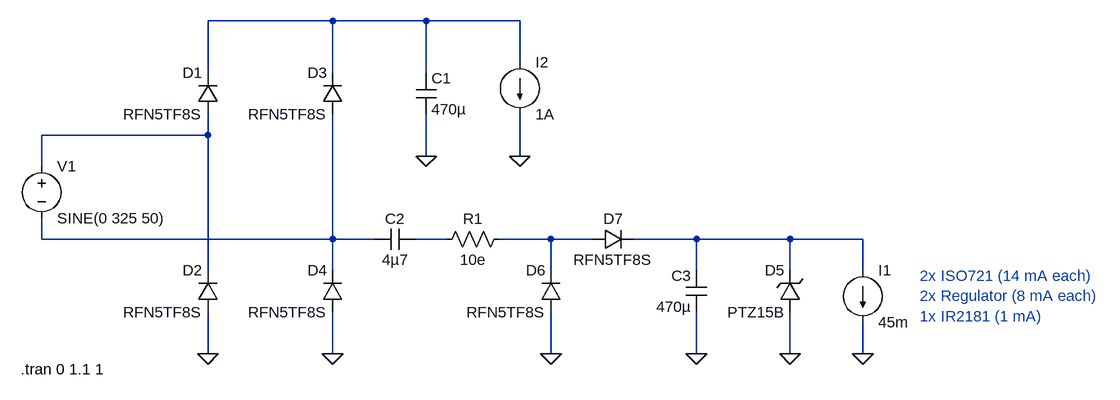
[diagram p0: schematic Primary Power.asc]
Primary Power.asc, the LTspice schematic file:
Version 4
SHEET 1 1720 680
WIRE 528 -80 336 -80
WIRE 672 -80 528 -80
WIRE 816 -80 672 -80
WIRE 816 -16 816 -80
WIRE 336 0 336 -80
WIRE 528 0 528 -80
WIRE 672 0 672 -80
WIRE 336 96 336 64
WIRE 336 96 80 96
WIRE 672 128 672 64
WIRE 816 128 816 64
WIRE 80 144 80 96
WIRE 80 256 80 224
WIRE 528 256 528 64
WIRE 528 256 80 256
WIRE 592 256 528 256
WIRE 704 256 656 256
WIRE 864 256 784 256
WIRE 928 256 864 256
WIRE 1088 256 992 256
WIRE 1232 256 1088 256
WIRE 1344 256 1232 256
WIRE 336 304 336 96
WIRE 528 304 528 256
WIRE 864 304 864 256
WIRE 1088 304 1088 256
WIRE 1232 304 1232 256
WIRE 1344 304 1344 256
WIRE 336 432 336 368
WIRE 528 432 528 368
WIRE 864 432 864 368
WIRE 1088 432 1088 368
WIRE 1232 432 1232 368
WIRE 1344 432 1344 384
FLAG 336 432 0
FLAG 528 432 0
FLAG 672 128 0
FLAG 1088 432 0
FLAG 1232 432 0
FLAG 1344 432 0
FLAG 816 128 0
FLAG 864 432 0
SYMBOL voltage 80 128 R0
WINDOW 123 0 0 Left 2
WINDOW 39 0 0 Left 2
SYMATTR InstName V1
SYMATTR Value SINE(0 325 50)
SYMBOL diode 352 64 R180
WINDOW 0 24 64 Left 2
WINDOW 3 24 0 Left 2
SYMATTR InstName D1
SYMATTR Value RFN5TF8S
SYMBOL diode 352 368 R180
WINDOW 0 24 64 Left 2
WINDOW 3 24 0 Left 2
SYMATTR InstName D2
SYMATTR Value RFN5TF8S
SYMBOL diode 544 64 R180
WINDOW 0 24 64 Left 2
WINDOW 3 24 0 Left 2
SYMATTR InstName D3
SYMATTR Value RFN5TF8S
SYMBOL diode 544 368 R180
WINDOW 0 24 64 Left 2
WINDOW 3 24 0 Left 2
SYMATTR InstName D4
SYMATTR Value RFN5TF8S
SYMBOL cap 656 0 R0
SYMATTR InstName C1
SYMATTR Value 470µ
SYMATTR SpiceLine Rser=1
SYMBOL cap 656 240 R90
WINDOW 0 0 32 VBottom 2
WINDOW 3 32 32 VTop 2
SYMATTR InstName C2
SYMATTR Value 4µ7
SYMBOL cap 1104 368 R180
WINDOW 0 24 56 Left 2
WINDOW 3 24 8 Left 2
SYMATTR InstName C3
SYMATTR Value 470µ
SYMBOL zener 1248 368 R180
WINDOW 0 24 64 Left 2
WINDOW 3 24 0 Left 2
SYMATTR InstName D5
SYMATTR Value PTZ15B
SYMATTR Description Diode
SYMATTR Type diode
SYMBOL current 816 -16 R0
WINDOW 123 0 0 Left 2
WINDOW 39 0 0 Left 2
SYMATTR InstName I2
SYMATTR Value 1A
SYMBOL diode 928 272 R270
WINDOW 0 32 32 VTop 2
WINDOW 3 0 32 VBottom 2
SYMATTR InstName D7
SYMATTR Value RFN5TF8S
SYMBOL diode 880 368 R180
WINDOW 0 24 64 Left 2
WINDOW 3 24 0 Left 2
SYMATTR InstName D6
SYMATTR Value RFN5TF8S
SYMBOL current 1344 304 R0
WINDOW 123 0 0 Left 2
WINDOW 39 0 0 Left 2
SYMATTR InstName I1
SYMATTR Value 45m
SYMBOL res 688 272 R270
WINDOW 0 32 56 VTop 2
WINDOW 3 0 56 VBottom 2
SYMATTR InstName R1
SYMATTR Value 10e
TEXT 48 456 Left 2 !.tran 0 1.1 1
TEXT 1432 312 Left 2 ;2x ISO721 (14 mA each)\n2x Regulator (8 mA each)\n1x IR2181 (1 mA)

The netlist it stands for:
* Primary Power.asc
V1 N002 N003 SINE(0 325 50)
D1 N002 N001 RFN5TF8S
D2 0 N002 RFN5TF8S
D3 N003 N001 RFN5TF8S
D4 0 N003 RFN5TF8S
C1 N001 0 470µ Rser=1
C2 N004 N003 4µ7
C3 0 N006 470µ
D5 0 N006 PTZ15B
I2 N001 0 1A
D7 N005 N006 RFN5TF8S
D6 0 N005 RFN5TF8S
I1 N006 0 45m
R1 N004 N005 10e
.model D D
.lib standard.dio
.tran 0 1.1 1
* 2x ISO721 (14 mA each)
* 2x Regulator (8 mA each)
* 1x IR2181 (1 mA)
.backanno
.end